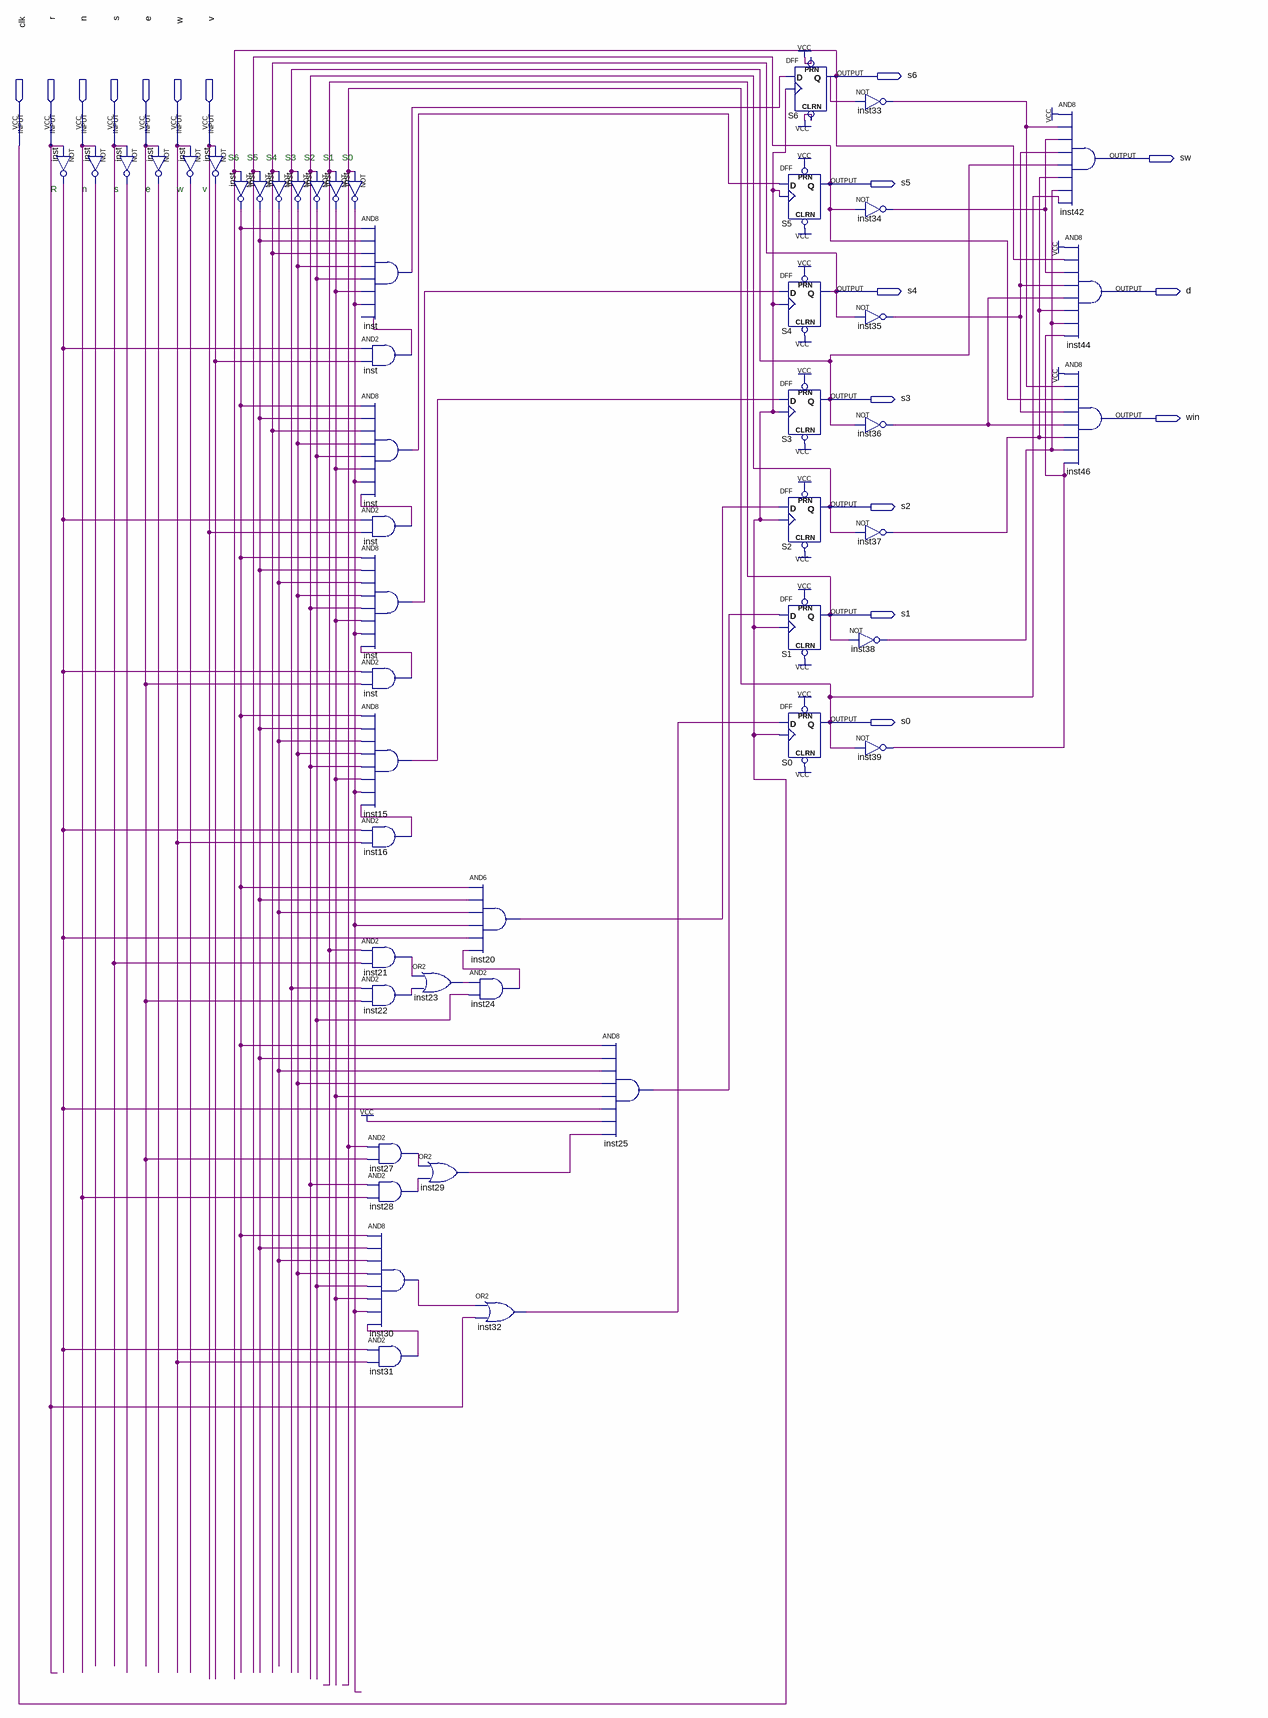
[diagram p0: schematic sheet]
// Quartus schematic room.bdf as structural Verilog: 50 symbols, 17 pins
module room (
  input  clk,
  input  r,
  input  n,
  input  s,
  input  e,
  input  w,
  input  v,
  output s6,
  output sw,
  output s5,
  output s4,
  output d,
  output s3,
  output win,
  output s2,
  output s1,
  output s0
);

  wire inst15_out, inst16_out, inst20_out, inst21_out, inst22_out, inst23_out, inst24_out, inst25_out,
       inst27_out, inst28_out, inst29_out, inst30_out, inst31_out, inst32_out, inst33_out, inst34_out,
       inst35_out, inst36_out, inst37_out, inst38_out, inst39_out, inst_out, inst_out_2, inst_out_3,
       inst_out_4, inst_out_5, inst_out_6, inst_out_7, inst_out_8, inst_out_9, inst_out_10, inst_out_11,
       inst_out_12, inst_out_13, inst_out_14, inst_out_15, inst_out_16, inst_out_17, inst_out_18, inst_out_19;

  not inst (inst_out_19, r);
  not inst_dup2 (inst_out_8, n);
  not inst_dup3 (inst_out_9, s);
  not inst_dup4 (inst_out_11, e);
  not inst_dup5 (inst_out_10, w);
  not inst_dup6 (inst_out, v);
  not inst_dup7 (inst_out_12, s6);
  not inst_dup8 (inst_out_13, s5);
  not inst_dup9 (inst_out_14, s4);
  not inst_dup10 (inst_out_15, s3);
  not inst_dup11 (inst_out_16, s2);
  not inst_dup12 (inst_out_17, s1);
  not inst_dup13 (inst_out_18, s0);
  and inst_dup14 (inst_out_3, inst_out_12, inst_out_13, s4, inst_out_15, inst_out_16, inst_out_17, inst_out_18, inst_out_2);
  and inst_dup15 (inst_out_2, inst_out_19, inst_out);
  and inst_dup16 (inst_out_5, inst_out_12, inst_out_13, s4, inst_out_15, inst_out_16, inst_out_17, inst_out_18, inst_out_4);
  and inst_dup17 (inst_out_4, inst_out_19, v);
  and inst_dup18 (inst_out_7, inst_out_12, inst_out_13, inst_out_14, inst_out_15, s2, inst_out_17, inst_out_18, inst_out_6);
  and inst_dup19 (inst_out_6, inst_out_19, e);
  and inst15 (inst15_out, inst_out_12, inst_out_13, inst_out_14, inst_out_15, s2, inst_out_17, inst_out_18, inst16_out);
  and inst16 (inst16_out, inst_out_19, w);
  and inst21 (inst21_out, s1, s);
  and inst22 (inst22_out, s3, e);
  and inst27 (inst27_out, s0, e);
  and inst28 (inst28_out, s2, n);
  and inst30 (inst30_out, inst_out_12, inst_out_13, inst_out_14, inst_out_15, inst_out_16, inst_out_17, inst_out_18, inst31_out);
  and inst31 (inst31_out, inst_out_19, w);
  or inst23 (inst23_out, inst21_out, inst22_out);
  or inst29 (inst29_out, inst27_out, inst28_out);
  and inst20 (inst20_out, inst_out_12, inst_out_13, inst_out_14, inst_out_18, inst_out_19, inst24_out);
  and inst24 (inst24_out, inst23_out, inst_out_16);
  or inst32 (inst32_out, inst30_out, r);
  and inst25 (inst25_out, inst_out_12, inst_out_13, inst_out_14, inst_out_15, inst_out_17, inst_out_19, 1'b1, inst29_out);
  DFF u_S6 (.CLRN(1'b1), .CLK(clk), .D(inst_out_3), .PRN(1'b1), .Q(s6));
  DFF u_S5 (.CLRN(1'b1), .CLK(clk), .D(inst_out_5), .PRN(1'b1), .Q(s5));
  DFF u_S4 (.CLRN(1'b1), .CLK(clk), .D(inst_out_7), .PRN(1'b1), .Q(s4));
  DFF u_S3 (.CLRN(1'b1), .CLK(clk), .D(inst15_out), .PRN(1'b1), .Q(s3));
  DFF u_S2 (.CLRN(1'b1), .CLK(clk), .D(inst20_out), .PRN(1'b1), .Q(s2));
  DFF u_S1 (.CLRN(1'b1), .CLK(clk), .D(inst25_out), .PRN(1'b1), .Q(s1));
  DFF u_S0 (.CLRN(1'b1), .CLK(clk), .D(inst32_out), .PRN(1'b1), .Q(s0));
  not inst33 (inst33_out, s6);
  not inst34 (inst34_out, s5);
  not inst35 (inst35_out, s4);
  not inst36 (inst36_out, s3);
  not inst37 (inst37_out, s2);
  not inst38 (inst38_out, s1);
  not inst39 (inst39_out, s0);
  and inst42 (sw, 1'b1, inst33_out, inst34_out, inst35_out, s3, inst37_out, inst38_out, s0);
  and inst44 (d, 1'b1, s6, inst34_out, inst35_out, inst36_out, inst37_out, inst38_out, inst39_out);
  and inst46 (win, 1'b1, inst33_out, s5, inst35_out, inst36_out, inst37_out, inst38_out, inst39_out);

  // Notes on the sheet:
  //   S6
  //   S5
  //   S4
  //   S3
  //   S2
  //   S1
  //   S0
  //   R
  //   n
  //   s
  //   e
  //   w
  //   v
endmodule
